# Altium schematic sheet Радиомодуль.SchDoc
size 209 x 297 mm; DocumentNumber: 10; SheetNumber: 10; SheetTotal: 11; ListNumber: 1
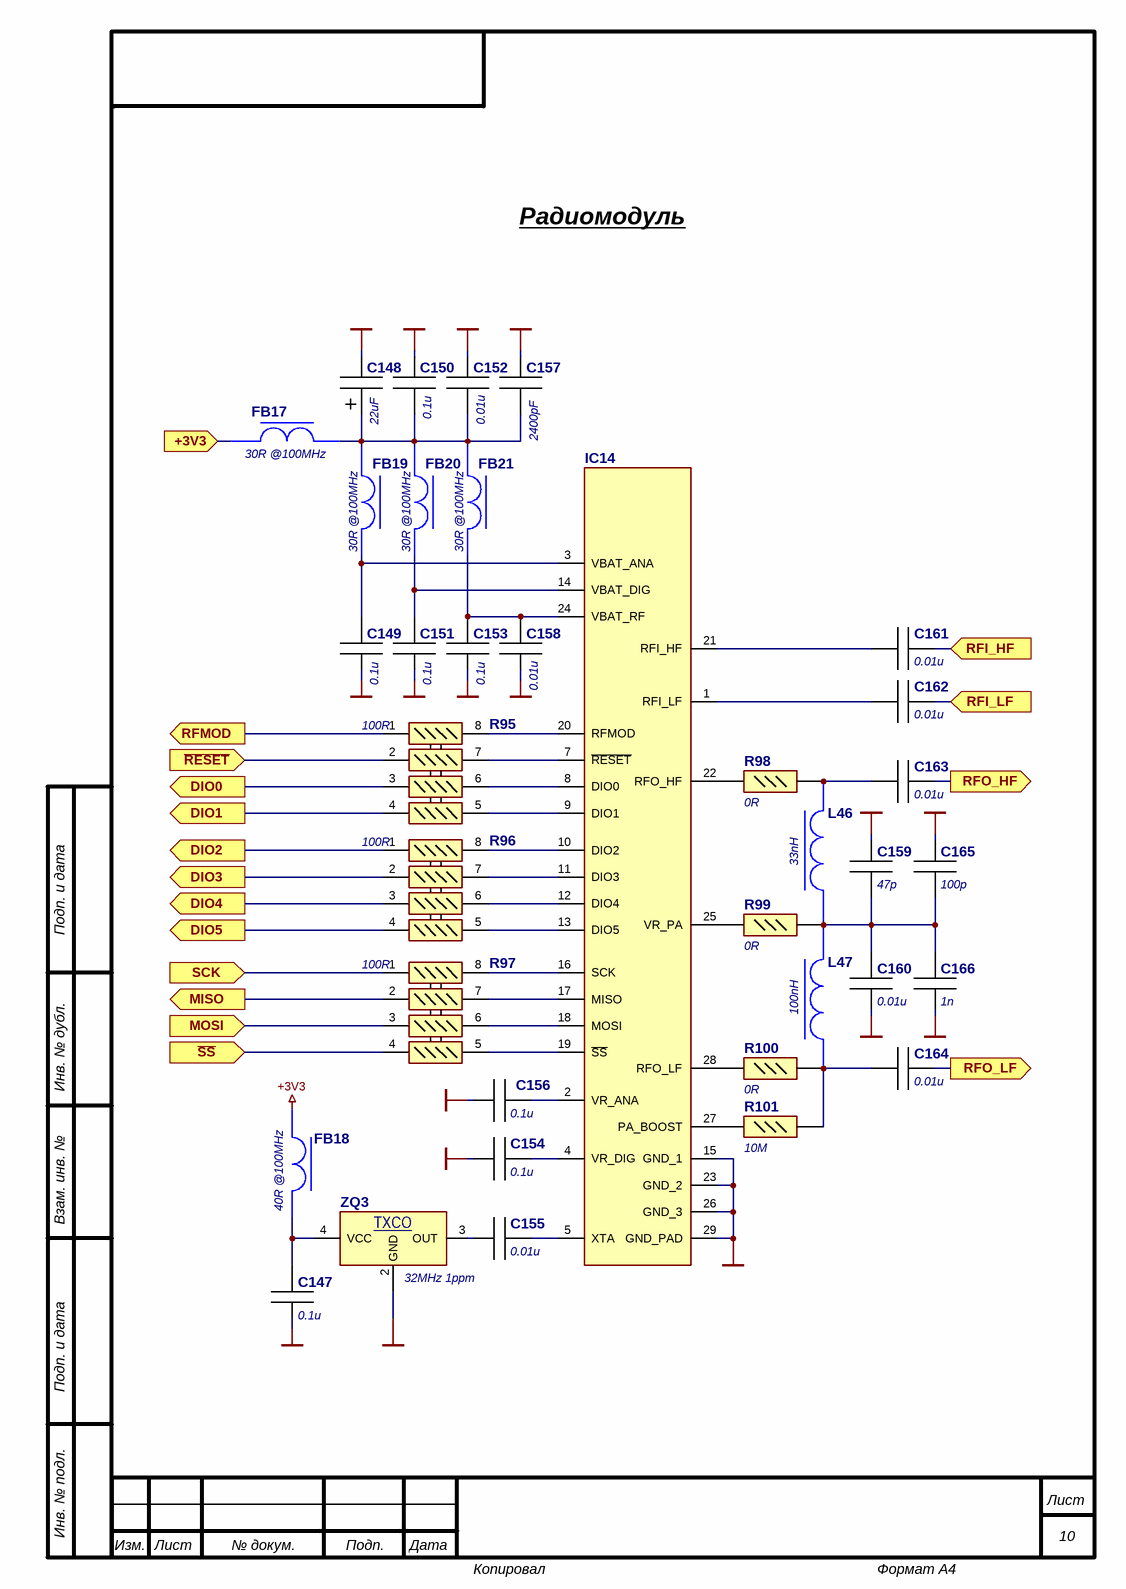
[diagram p0: Радиомодуль.SchDoc]

## Parts
C147  0.1u  [:CAP0402 100x50x50]
C148  22uF  [:CAP1206 C3216-18]
C149  0.1u  [:CAP0402 100x50x50]
C150  0.1u  [:CAP0402 100x50x50]
C151  0.1u  [:CAP0402 100x50x50]
C152  0.01u  [:CAP0402 100x50x50]
C153  0.1u  [:CAP0402 100x50x50]
C154  0.1u  [:CAP0402 100x50x50]
C155  0.01u  [:CAP0402 100x50x50]
C156  0.1u  [:CAP0402 100x50x50]
C157  2400pF  [:CAP0805 C2012X125]
C158  0.01u  [:CAP0402 100x50x50]
C159  47p  [:CAP0402 100x50x50]
C160  0.01u  [:CAP0402 100x50x50]
C161  0.01u  [:CAP0402 100x50x50]
C162  0.01u  [:CAP0402 100x50x50]
C163  0.01u  [:CAP0402 100x50x50]
C164  0.01u  [:CAP0402 100x50x50]
C165  100p  [:CAP0402 100x50x50]
C166  1n  [:CAP0402 100x50x50]
FB17  30R @100MHz  [:FER BLM18SP300SN1D]
FB18  40R @100MHz  [:FER MMZ1005Y400CTD25]
FB19  30R @100MHz  [:FER BLM18SP300SN1D]
FB20  30R @100MHz  [:FER BLM18SP300SN1D]
FB21  30R @100MHz  [:FER BLM18SP300SN1D]
IC14  SX1276IMLTRT  [:QFN28 P600X600X100-29N-D]  (value not drawn)
L46  33nH  [:IND 0603 (1608)]
L47  100nH  [:IND 0603 (1608)]
R95  100R  [:RES0402x4]
R96  100R  [:RES0402x4]
R97  100R  [:RES0402x4]
R98  Manufacturer_Part_Number (part 2: value): 0R  [:RES0402]  (hidden comment: RC0402FR-07)
R99  Manufacturer_Part_Number (part 2: value): 0R  [:RES0402]  (hidden comment: RC0402FR-07)
R100  Manufacturer_Part_Number (part 2: value): 0R  [:RES0402]  (hidden comment: RC0402FR-07)
R101  Manufacturer_Part_Number (part 2: value): 10M  [:RES0402]  (hidden comment: RC0402FR-07)
ZQ3  32MHz 1ppm  [:RESO STC22K33R48-32.000MT]

## Ports
+3V3 (in), DIO0 (out), DIO1 (out), DIO2 (out), DIO3 (out), DIO4 (out), DIO5 (out), MISO (out), MOSI (in), RFI_HF (in), RFI_LF (in), RFMOD (out), RFO_HF (out), RFO_LF (out), SCK (in), ~{RESET} (in), ~{SS} (in)

## Nets
+3V3: FB18.1
GND: C147.1 C148.2 C149.1 C150.2 C151.1 C152.2 C153.1 C154.1 C156.1 C157.2 C158.1 C159.1 C160.1 C165.2 C166.1 IC14.15(GND_1) IC14.23(GND_2) IC14.26(GND_3) IC14.29(GND_PAD) ZQ3.2(GND)
+3V3: FB17.1 ; port +3V3  [a separate net that carries the same name]
DIO0: R95.3 ; port DIO0
DIO1: R95.4 ; port DIO1
DIO2: R96.1 ; port DIO2
DIO3: R96.2 ; port DIO3
DIO4: R96.3 ; port DIO4
DIO5: R96.4 ; port DIO5
MISO: R97.2 ; port MISO
MOSI: R97.3 ; port MOSI
~{RESET}: R95.2 ; port ~{RESET}
RFI_HF: C161.1 ; port RFI_HF
RFI_LF: C162.1 ; port RFI_LF
RFMOD: R95.1 ; port RFMOD
RFO_HF: C163.1 ; port RFO_HF
RFO_LF: C164.1 ; port RFO_LF
~{SS}: R97.4 ; port ~{SS}
SCK: R97.1 ; port SCK
NetC147_2: C147.2 FB18.2 ZQ3.4(VCC)
NetC148_1: C148.1(+) C150.1 C152.1 C157.1 FB17.2 FB19.1 FB20.1 FB21.1
NetC149_2: C149.2 FB19.2 IC14.3(VBAT_ANA)
NetC151_2: C151.2 FB20.2 IC14.14(VBAT_DIG)
NetC153_2: C153.2 C158.2 FB21.2 IC14.24(VBAT_RF)
NetC154_2: C154.2 IC14.4(VR_DIG)
NetC155_1: C155.1 IC14.5(XTA)
NetC155_2: C155.2 ZQ3.3(OUT)
NetC156_2: C156.2 IC14.2(VR_ANA)
NetC159_2: C159.2 C160.2 C165.1 C166.2 L46.1 L47.1 R99.1
NetC161_2: C161.2 IC14.21(RFI_HF)
NetC162_2: C162.2 IC14.1(RFI_LF)
NetC163_2: C163.2 L46.2 R98.1
NetC164_2: C164.2 L47.2 R100.1 R101.1
NetIC14_7: IC14.7(~{RESET}) R95.7
NetIC14_8: IC14.8(DIO0) R95.6
NetIC14_9: IC14.9(DIO1) R95.5
NetIC14_10: IC14.10(DIO2) R96.8
NetIC14_11: IC14.11(DIO3) R96.7
NetIC14_12: IC14.12(DIO4) R96.6
NetIC14_13: IC14.13(DIO5) R96.5
NetIC14_16: IC14.16(SCK) R97.8
NetIC14_17: IC14.17(MISO) R97.7
NetIC14_18: IC14.18(MOSI) R97.6
NetIC14_19: IC14.19(~{SS}) R97.5
NetIC14_20: IC14.20(RFMOD) R95.8
NetIC14_22: IC14.22(RFO_HF) R98.2
NetIC14_25: IC14.25(VR_PA) R99.2
NetIC14_27: IC14.27(PA_BOOST) R101.2
NetIC14_28: IC14.28(RFO_LF) R100.2

## Notes on the sheet
- Радиомодуль
- Подп. и дата
- Инв. № дубл.
- Взам. инв. №
- Инв. № подл.
- Лист
- Изм.
- № докум.
- Подп.
- Дата
- Копировал
- Формат А4
- (in symbol STC22K33R48-32.000MT) TXCO

## Library data of the parts
C147 C149-C151 C153 C154 C156 = GRM155R71E104KE14J: ±10% 25V Ceramic Capacitor X7R 0402 (1005 Metric); Manufacturer_Name: Murata Electronics; Short Description: 0402 0.1uF 25V; Datasheet Link: http://www.murata.com/~/media/webrenewal/support/library/catalog/products/capacitor/mlcc/c02e.pdf; Height: 0.55mm; Manufacturer_Part_Number: GRM155R71E104KE14J; Mouser Part Number: 81-GRM155R71E104KE4J; Mouser Price/Stock: https://www.mouser.co.uk/ProductDetail/Murata-Electronics/GRM155R71E104KE14J?qs=hNud%2FORuBR2EQtvG2InwAQ%3D%3D; Arrow Part Number: GRM155R71E104KE14J; Arrow Price/Stock: https://www.arrow.com/en/products/grm155r71e104ke14j/murata-manufacturing
C148 = TPSA226K006R0300: 22µF Molded Tantalum Capacitors 6.3V 1206 (3216 Metric) 300mOhm @ 100kHz; Manufacturer_Name: AVX; Short Description: 1206 22uF 6V3; Manufacturer_Part_Number: TPSA226K006R0300
C152 C155 C158 C160-C164 = GRM1555CYA103JE01D: ±5% 35V Ceramic Capacitor C0G, NP0 0402 (1005 Metric); Manufacturer_Name: Murata Electronics; Short Description: 0402 0.01u 35V; Datasheet Link: https://search.murata.co.jp/Ceramy/image/img/A01X/G101/ENG/GRM1555CYA103JE01-01A.pdf; Height: 0.55mm; Manufacturer_Part_Number: GRM1555CYA103JE01D
C157 = C08BL242X-5UN-X0T: 2400pF 50V Ceramic Capacitor 0805 (2012 Metric); Manufacturer_Name: Knowles Novacap; Short Description: 0805 2400pF 50V; Manufacturer_Part_Number: C08BL242X-5UN-X0T
C159 = GJM1555C1H470GB01D: CAP CER  50V C0G/NP0 0402; Manufacturer_Name: Murata Electronics; Short Description: 0402 47p 50V; Manufacturer_Part_Number: GJM1555C1H470GB01D
C165 = GCM1555C1H101JA16D: CAP CER  50V C0G/NP0 0402; Manufacturer_Name: Murata Electronics; Short Description: 0402 100p 50V; Manufacturer_Part_Number: GCM1555C1H101JA16D
C166 = GRM1555C1H102JA01J: ±5% 50V Ceramic Capacitor C0G, NP0 0402 (1005 Metric); Manufacturer_Name: Murata Electronics; Short Description: 0402 1n 50V; Height: 0.55mm; Manufacturer_Part_Number: GRM1555C1H102JA01J
FB17 FB19-FB21 = BLM18SP300SN1D: 30 Ohms @ 100MHz 1 Power Line Ferrite Bead 0603 (1608 Metric) 6A 8mOhm; Manufacturer_Name: Murata Electronics; Short Description: 0603 30R @100MHz; Datasheet Link: http://www.murata.com/~/media/webrenewal/support/library/catalog/products/emc/emifil/c31e.ashx?la=en-gb; Height: 0.95mm; Manufacturer_Part_Number: BLM18SP300SN1D; Mouser Part Number: 81-BLM18SP300SN1D; Mouser Price/Stock: https://www.mouser.co.uk/ProductDetail/Murata-Electronics/BLM18SP300SN1D/?qs=W%2FMpXkg%252BdQ4o%252BOP%252B6m8FYA%3D%3D
FB18 = MMZ1005Y400CTD25: 40 Ohms @ 100MHz 1 Signal Line Ferrite Bead 0402 (1005 Metric) 550mA 100mOhm; Manufacturer_Name: TDK; Short Description: 0402 40R @100MHz; Datasheet Link: https://www.arrow.com/en/products/mmz1005y400ctd25/tdk; Height: 0.55mm; Manufacturer_Part_Number: MMZ1005Y400CTD25; Mouser Part Number: 810-MMZ1005Y400CTD25; Mouser Price/Stock: https://www.mouser.com/Search/Refine.aspx?Keyword=810-MMZ1005Y400CTD25; Arrow Part Number: MMZ1005Y400CTD25; Arrow Price/Stock: https://www.arrow.com/en/products/mmz1005y400ctd25/tdk
IC14 = SX1276IMLTRT: LoRa RF Transceiver 3 BANDS; Manufacturer_Name: SEMTECH; Short Description: LoRa RF; Datasheet Link: https://componentsearchengine.com/Datasheets/1/SX1276IMLTRT.pdf; Height: 1mm; Manufacturer_Part_Number: SX1276IMLTRT; Mouser Part Number: 947-SX1276IMLTRT; Mouser Price/Stock: https://www.mouser.co.uk/ProductDetail/Semtech/SX1276IMLTRT/?qs=rBWM4%252BvDhIceYQoeMKd%2FQQ%3D%3D; Arrow Part Number: SX1276IMLTRT; Arrow Price/Stock: https://www.arrow.com/en/products/sx1276imltrt/semtech
L46 = LQW18AN33NJ8ZD: Unshielded Multilayer Inductor 0603 5%; Manufacturer_Name: Murata Electronics; Short Description: 33nH 1.1A 110mOhm; Manufacturer_Part_Number: LQW18AN33NJ8ZD
L47 = LQW18ANR10J8ZD: Unshielded Multilayer Inductor 0603 5%; Manufacturer_Name: Murata Electronics; Short Description: 100nH 0.19A 0.63Ohm; Manufacturer_Part_Number: LQW18ANR10J8ZD
R95-R97 = EXB-N8V101JX: 100 Ohm ±5% 31mW Power Per Element Isolated 4 Resistor Network/Array ±200ppm/°C 0804, Concave, Long Side Terminals; Manufacturer_Name: Panasonic; Short Description: 0804 5% 100R; Datasheet Link: https://industrial.panasonic.com/cdbs/www-data/pdf/AOC0000/AOC0000C14.pdf; Height: 0.55mm; Manufacturer_Part_Number: EXB-N8V101JX; Mouser Part Number: 667-EXB-N8V101JX; Mouser Price/Stock: https://www.mouser.co.uk/ProductDetail/Panasonic/EXB-N8V101JX?qs=cttFivMKqWxyXyoXALoehw%3D%3D; Arrow Part Number: EXB-N8V101JX; Arrow Price/Stock: https://www.arrow.com/en/products/exbn8v101jx/panasonic
R98-R101 = RC0402FR-07: Resistor 0402 1% 1/16W / Value Range: 1Ω ... 10 MΩ / Value Example: / 0R = 0Ω / 97R6 = 97.6Ω / 9K76 = 9760Ω / 1M = 1,000,000Ω; Manufacturer_Name: YAGEO; Manufacturer_Part_Number (part 3: after value): L; Short Description: 0402 1%; Datasheet Link: http://www.yageo.com/documents/recent/PYu-RC0402_51_RoHS_L_6_r.pdf; Height: 0.4mm; Manufacturer_Part_Number: RC0402FR-07; Parameter 1: *
ZQ3 = STC22K33R48-32.000MT: 32MHz TCXO Clipped Sine Wave Oscillator 3.3V 2mA 4-SMD, / -40°C ~ 85°C; Manufacturer_Name: Suntsu Electronics, Inc.; Datasheet Link: https://suntsu.com/wp-content/uploads/2019/07/STC22K-Series.pdf; Manufacturer_Part_Number: STC22K33R48-32.000MT; Short Description: 32MHz 1ppm